# EAGLE design trezor_diy_dev (EAGLE 7.3.0)
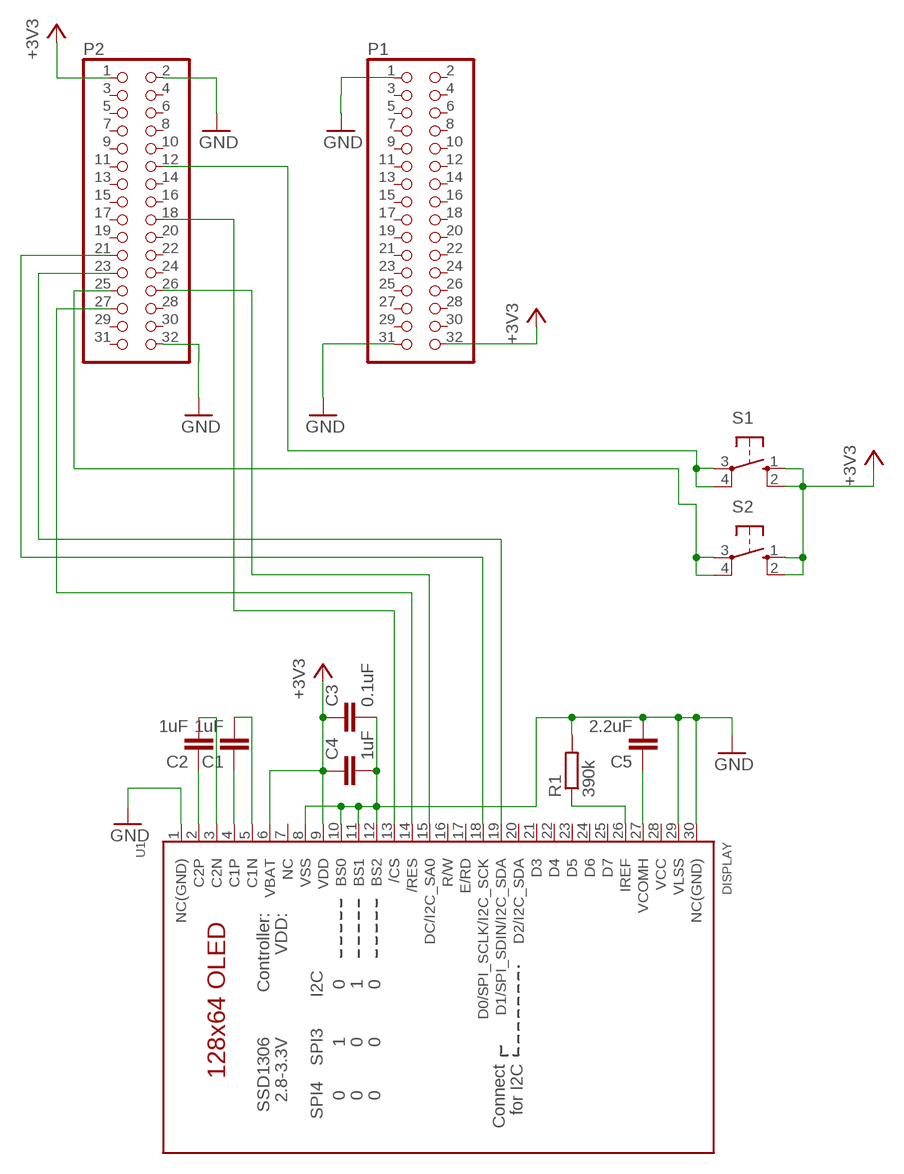
[diagram p0: schematic, sheet 1]

## Parts
C1  1uF  C5/2.5  [C5B2.5]
C2  1uF  C5/2.5  [C5B2.5]
C3  0.1uF  C5/2.5  [C5B2.5]
C4  1uF  C5/2.5  [C5B2.5]
C5  2.2uF  C5/2.5  [C5B2.5]
P1  PINHD-2X16  [2X16]
P2  PINHD-2X16  [2X16]
R1  390k  R-EU_0309/10  [0309/10]
S1  10-XX  [B3F-10XX]
S2  10-XX  [B3F-10XX]
U1  DISPLAY  DISP_OLED_UG-2864HSWEG010.96"  [UG-2864HSWEG01_0.96IN_WRAPAROUND]

## Nets
+3V3: C3.1 C4.1 P1.32 P2.1 S1.1(S) S1.2(S1) S2.1(S) S2.2(S1) U1.6(VBAT) U1.9(VDD)
GND: C3.2 C4.2 C5.2 P1.1 P1.31 P2.2 P2.32 R1.2 U1.1(NC(GND)) U1.8(VSS) U1.10(BS0) U1.11(BS1) U1.12(BS2) U1.29(VLSS) U1.30(NC(GND))
N$1: C2.2 U1.3(C2N)
N$2: P2.25 S2.3(P) S2.4(P1)
N$3: P2.12 S1.3(P) S1.4(P1)
N$4: P2.26 U1.15(DC/I2C_SA0)
N$5: P2.21 U1.18(D0/SPI_SCLK/I2C_SCK)
N$6: C5.1 U1.27(VCOMH)
N$7: P2.18 U1.13(/CS)
N$8: P2.27 U1.14(/RES)
N$9: R1.1 U1.26(IREF)
N$10: C2.1 U1.2(C2P)
N$11: C1.1 U1.4(C1P)
N$13: C1.2 U1.5(C1N)
N$15: P2.23 U1.19(D1/SPI_SDIN/I2C_SDA)
Unconnected: P1.2 P1.3 P1.4 P1.5 P1.6 P1.7 P1.8 P1.9 P1.10 P1.11 P1.12 P1.13 P1.14 P1.15 P1.16 P1.17 P1.18 P1.19 P1.20 P1.21 P1.22 P1.23 P1.24 P1.25 P1.26 P1.27 P1.28 P1.29 P1.30 P2.3 P2.4 P2.5 P2.6 P2.7 P2.8 P2.9 P2.10 P2.11 P2.13 P2.14 P2.15 P2.16 P2.17 P2.19 P2.20 P2.22 P2.24 P2.28 P2.29 P2.30 P2.31 U1.7(NC) U1.16(R/W) U1.17(E/RD) U1.20(D2/I2C_SDA) U1.21(D3) U1.22(D4) U1.23(D5) U1.24(D6) U1.25(D7)

## Power pins joined to a net without a drawn wire
3V3: U1.28(VCC)

## Library data of the parts
C1-C5 = capacitor-wima:C: CAPACITOR naming: grid - package width
P1 P2 = pinhead:PINHD-2X16: PIN HEADER
R1 = rcl:R-EU_: RESISTOR, European symbol
S1 S2 = switch-omron:10-XX: OMRON SWITCH; MPN: B3F-1000; OC_FARNELL: 176432; OC_NEWARK: 36M3542
U1 = microbuilder:DISP_OLED_UG-2864HSWEG01: UG-2864HSWEG01 OLED display Both 1.3" and 0.96" models share the same FPC tab footprint, only the screen dimensions vary.

## Board
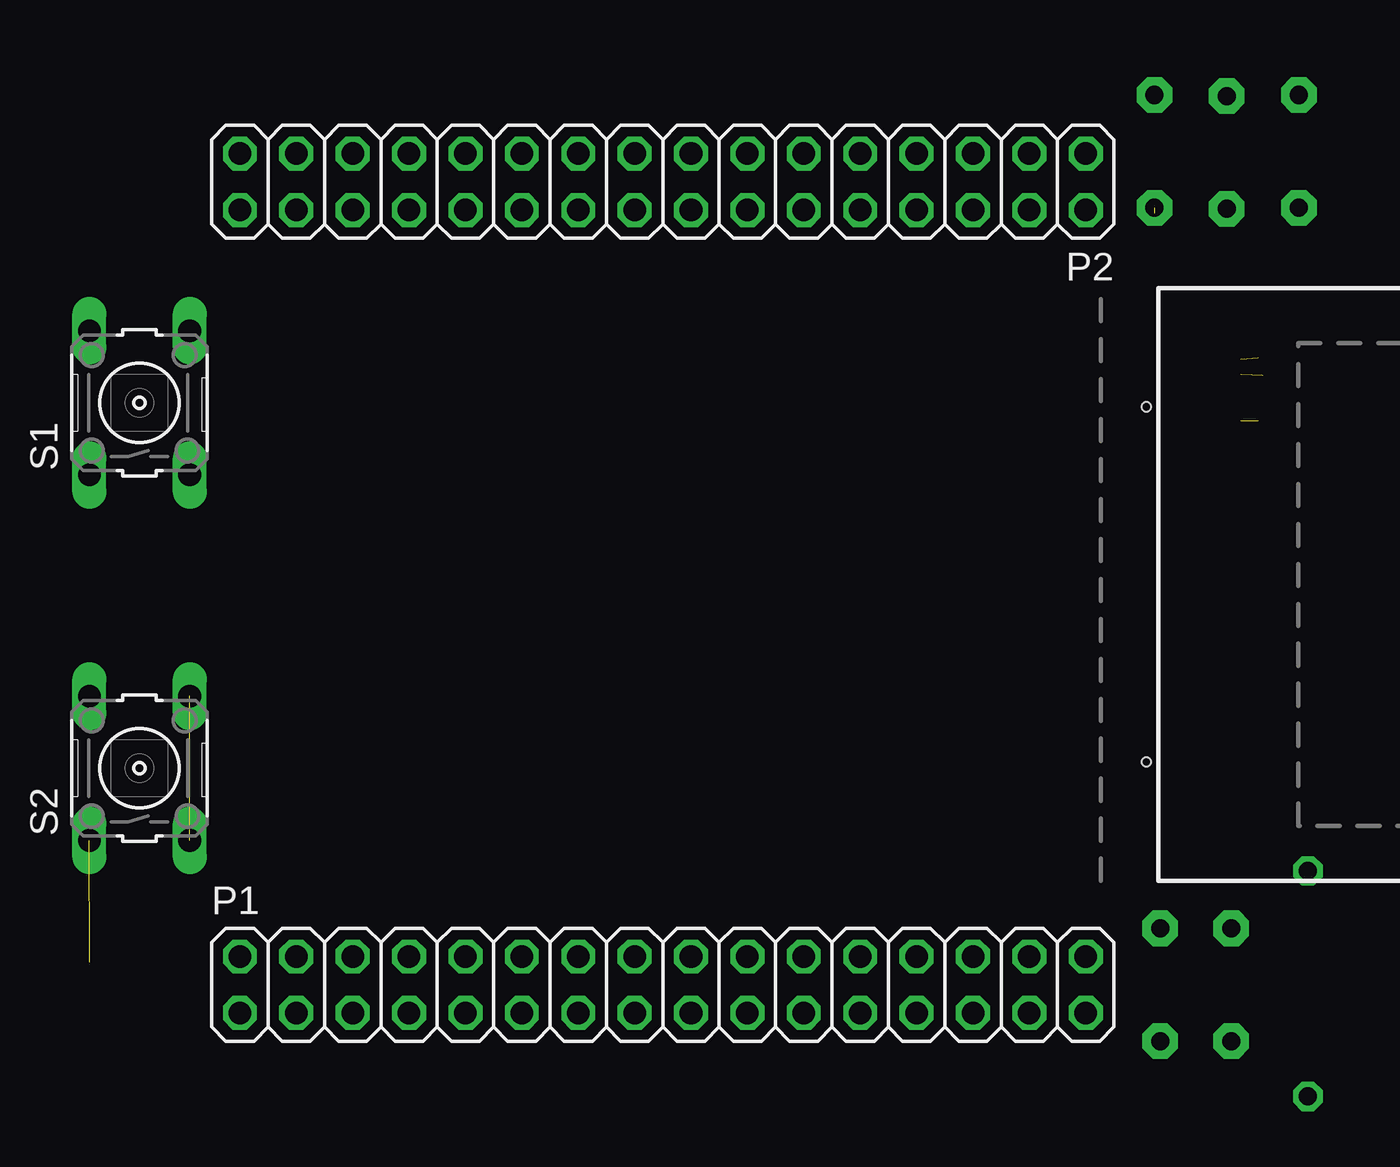
[diagram p1: board, top side]
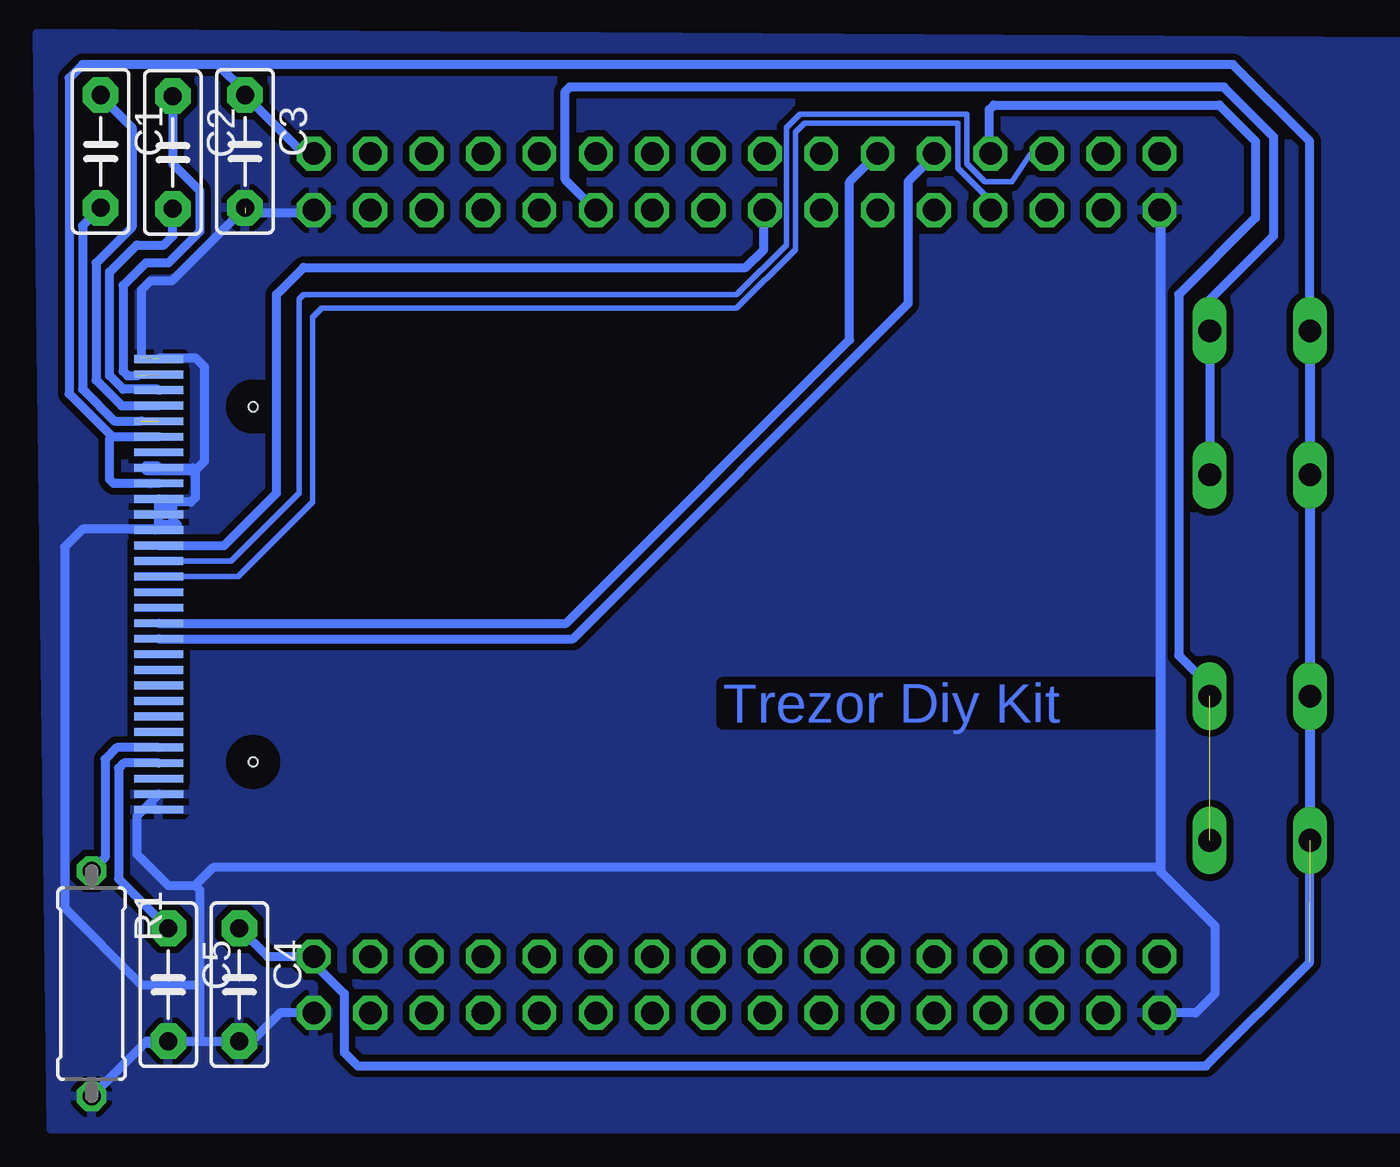
[diagram p2: board, bottom side, seen from below]

No outline drawn. Coordinates in mm, seen from the top.
Copper layers (1*16): Top 0.035mm / dielectric 1.5mm / Bottom 0.035mm
Design rules "default *": minimum track width 12mil, minimum drill 24mil, track to track 12mil, track to pad 12mil, pad to pad 12mil, via to via 12mil, smd to smd 8mil, copper to edge 40mil, drill to drill 8mil, minimum pad ring 10mil, minimum via ring 8mil, stop-mask expansion 4mil, vias tented up to drill 0mil, thermal gap 10mil

### Footprints (pad centres in the part's own frame; a part is rotated, then mirrored left to right if it is on the bottom)
C5B2.5 = drill 0.813 pad 1.6 octagon: 1 -2.54,0; 2 2.54,0
2X16 = drill 1.016 octagon: 1 -19.05,-1.27; 2 -19.05,1.27; 3 -16.51,-1.27; 4 -16.51,1.27; 5 -13.97,-1.27; 6 -13.97,1.27; 7 -11.43,-1.27; 8 -11.43,1.27; 9 -8.89,-1.27; 10 -8.89,1.27; 11 -6.35,-1.27; 12 -6.35,1.27; 13 -3.81,-1.27; 14 -3.81,1.27; 15 -1.27,-1.27; 16 -1.27,1.27; 17 1.27,-1.27; 18 1.27,1.27; 19 3.81,-1.27; 20 3.81,1.27; 21 6.35,-1.27; 22 6.35,1.27; 23 8.89,-1.27; 24 8.89,1.27; 25 11.43,-1.27; 26 11.43,1.27; 27 13.97,-1.27; 28 13.97,1.27; 29 16.51,-1.27; 30 16.51,1.27; 31 19.05,-1.27; 32 19.05,1.27
0309/10 = drill 0.813 octagon: 1 -5.08,0; 2 5.08,0
B3F-10XX = drill 1.016 long: 1 -3.251,2.261; 2 3.251,2.261; 3 -3.251,-2.261; 4 3.251,-2.261
UG-2864HSWEG01_0.96IN_WRAPAROUND = smd 0.35 x 2.2 bottom: 1 -10.15,-1.2; 2 -9.45,-1.2; 3 -8.75,-1.2; 4 -8.05,-1.2; 5 -7.35,-1.2; 6 -6.65,-1.2; 7 -5.95,-1.2; 8 -5.25,-1.2; 9 -4.55,-1.2; 10 -3.85,-1.2; 11 -3.15,-1.2; 12 -2.45,-1.2; 13 -1.75,-1.2; 14 -1.05,-1.2; 15 -0.35,-1.2; 16 0.35,-1.2; 17 1.05,-1.2; 18 1.75,-1.2; 19 2.45,-1.2; 20 3.15,-1.2; 21 3.85,-1.2; 22 4.55,-1.2; 23 5.25,-1.2; 24 5.95,-1.2; 25 6.65,-1.2; 26 7.35,-1.2; 27 8.05,-1.2; 28 8.75,-1.2; 29 9.45,-1.2; 30 10.15,-1.2 | hole 0.4: -8,-5.45; 8,-5.45

### Placement (x,y rotation side)
C1  62.18,44.04 270 bottom
C2  58.93,43.99 270 bottom
C3  55.68,44.04 270 bottom
C4  55.93,6.5 270 bottom
C5  59.13,6.5 270 bottom
P1  33.53,6.5 0 top
P2  33.53,42.67 180 top
R1  62.59,6.55 270 bottom
S1  9.96,32.72 90 top
S2  9.96,16.26 90 top
U1  60.76,24.54 270 top

### Tracks (layer width: path | path; a pad name or v marks a point on that pad's centre or on a via)
+3V3  (1 unrouted)
  Bottom 0.406: P2.1 53.03,43.94 C3.1 55.83,46.74 56.29,46.74 55.68,46.13 55.47,46.13 55.68,46.33 55.68,46.74 56.9,47.95 | 56.9,47.95 62.99,47.95 63.6,47.35 63.6,33.12 61.67,31.19 | 61.67,31.19 U1.6 | 61.67,31.19 61.77,31.08 61.77,29.26 61.6,29.09 U1.9 59.91,29.09 59.94,29.06 | S1.2 S1.1 S2.2 S2.1 | 55.88,9.14 55.88,9.09 C4.1 54.66,7.77 P1.32 52.73,7.92 53.03,7.92 51.21,6.1 51.21,3.45 50.6,2.85 12.39,2.85 7.72,7.52 7.72,44.5 11.18,47.95 56.9,47.95
GND  (2 unrouted)
  Bottom 0.406: P1.31 54.1,5.23 55.37,3.96 C4.2 57.71,3.96 | P2.2 52.73,41.25 55.68,41.25 | 57.91,29.67 60.15,29.67 60.15,29.87 59.64,29.87 U1.8 58.03,29.79 57.91,29.67 | U1.1 59.5,34.75 57.91,34.75 57.51,34.34 57.51,30.07 57.91,29.67 | 57.91,29.67 57.91,28.45 58.12,28.25 58.93,28.25 58.93,28.04 | 58.93,28.04 58.93,27.43 58.73,27.23 59.31,27.23 U1.12 | U1.12 U1.11 | U1.11 U1.10 | 60.1,3.96 C5.2 57.71,3.96 | 60.1,3.96 R1.2 | 60.1,3.96 59.99,3.86 59.13,3.86 | U1.29 59.98,14.66 | 59.98,14.66 60.55,14.09 60.55,12.39 59.13,10.97 57.91,10.97 | 57.91,10.97 57.71,10.77 57.71,6.5 | 57.71,6.5 57.71,3.96 | 14.43,11.79 14.43,41.35 P2.32 14.48,11.84 14.43,11.79 | 14.43,11.79 14.43,11.58 11.99,9.14 11.99,6.1 12.85,5.23 P1.1 | U1.11 59.2,28.04 58.93,28.04 | C3.2 58.98,38.2 59.94,38.2 60.35,37.8 60.35,34.75 | U1.12 59.6,27.03 62.99,27.03 63.8,26.21 63.8,9.96 60.35,6.5 57.71,6.5 | 14.43,11.79 57.1,11.79 57.91,10.97 | U1.30 59.7,14.39 59.98,14.66
  pour Bottom: -0.2,0 64.41,0 65.02,49.38 -0.2,48.97
N$1
  Bottom 0.406: U1.3 59.59,33.33 61.16,33.33 61.77,33.93 61.77,38.61 60.55,39.83 59.33,39.83 58.93,40.23 C2.2
N$2  (1 unrouted)
  Bottom 0.406: P2.25 22.15,43.99 22.15,45.92 21.95,46.13 11.79,46.13 10.16,44.5 10.16,41.05 13.61,37.59 13.61,21.34 12.22,19.94 S2.4
N$3
  Bottom 0.406: P2.12 41.25,42.77 41.25,46.74 41.05,46.94 11.58,46.94 9.35,44.7 9.35,40.23 12.22,37.36 S1.4 S1.3
N$4
  Bottom 0.254: 22.15,41.45 22.15,41.86 23.57,43.28 23.57,45.31 30.48,45.31 30.89,44.91 30.89,39.62 33.53,36.98 52.22,36.98 52.63,36.58 52.63,28.25 55.99,24.89 U1.15
  Bottom 0.305: P2.26 22.1,41.3 22.15,41.25 22.15,41.45
N$5
  Bottom 0.406: 27.18,43.74 P2.21 28.45,42.67 28.45,35.56 41.22,22.79 U1.18
N$6
  Bottom 0.406: U1.27 61.14,16.49 61.37,16.26 61.37,11.28 C5.1
N$7
  Bottom 0.406: U1.13 56.62,26.29 54.25,28.65 54.25,37.59 53.03,38.81 33.12,38.81 32.31,39.62 32.31,41.35 P2.18
N$8
  Bottom 0.254: 19.71,43.89 20.32,43.89 21.13,42.67 22.35,42.67 23.16,43.48 23.16,45.72 30.68,45.72 31.29,45.11 31.29,39.83 33.53,37.59 53.03,37.59 53.24,37.39 53.24,28.65 56.3,25.59 U1.14
  Bottom 0.305: P2.27 19.66,43.94 19.71,43.89
N$9
  Bottom 0.406: U1.26 61.45,17.19 61.98,16.66 61.98,12.24 R1.1
N$10  (1 unrouted)
  Bottom 0.406: C2.1 58.93,43.48 57.71,42.27 57.71,40.44 59.13,39.01 60.15,39.01 61.16,38 61.16,34.14 60.96,33.93 60.55,33.93
N$11
  Bottom 0.406: C1.1 62.33,46.74 62.38,46.74 60.76,45.11 60.76,40.64 62.38,39.01 62.38,33.73 61.24,32.59 U1.4
N$13  (1 unrouted)
  Bottom 0.406: C1.2 62.99,40.69 62.99,33.33 61.57,31.9 60.35,31.9
N$15
  Bottom 0.406: U1.19 40.91,22.09 25.81,37.19 25.81,42.67 24.64,43.84 P2.23

### Text on the board
Bottom: Trezor Diy Kit